# Altium schematic sheet Esquematico.SchDoc
size A4
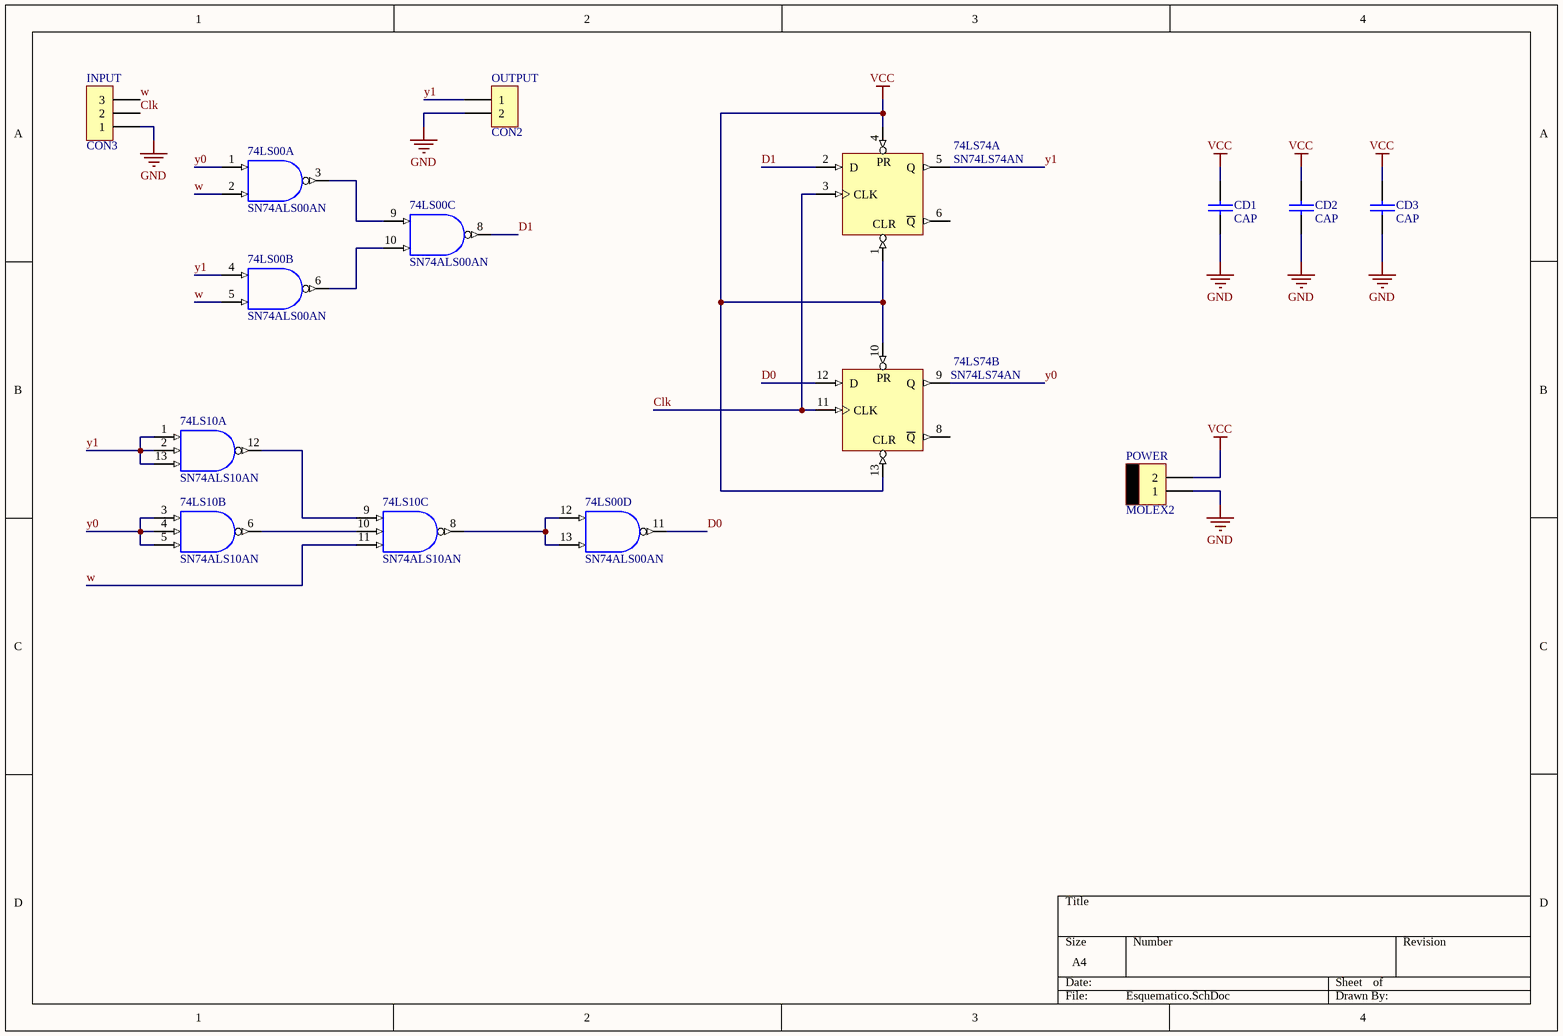
[diagram p0: Esquematico.SchDoc]

## Parts
74LS00  SN74ALS00AN  [N014]  (parts A,B,C,D of 4)
74LS10  SN74ALS10AN  [N014]  (parts A,B,C of 3)
74LS74  SN74LS74AN  [N014D]  (parts A,B of 2)
CD1  CAP  [CAP200]
CD2  CAP  [CAP200]
CD3  CAP  [CAP200]
INPUT  CON3  [SIP3]
OUTPUT  CON2  [SIP2]
POWER  MOLEX2  [MOLEX2]

## Nets
GND: 74LS00.7(GND) 74LS10.7(GND) 74LS74.7(GND) CD1.1 CD2.1 CD3.1 INPUT.1 OUTPUT.2 POWER.1
VCC: 74LS00.14(VCC) 74LS10.14(VCC) 74LS74.1(CLR) 74LS74.4(PR) 74LS74.10(PR) 74LS74.13(CLR) 74LS74.14(VCC) CD1.2 CD2.2 CD3.2 POWER.2
Clk: 74LS74.3(CLK) 74LS74.11(CLK) INPUT.2
D0: 74LS00.11(Y) 74LS74.12(D)
D1: 74LS00.8(Y) 74LS74.2(D)
w: 74LS00.2(B) 74LS00.5(B) 74LS10.11(C) INPUT.3
y0: 74LS00.1(A) 74LS10.3(A) 74LS10.4(B) 74LS10.5(C) 74LS74.9(Q)
y1: 74LS00.4(A) 74LS10.1(A) 74LS10.2(B) 74LS10.13(C) 74LS74.5(Q) OUTPUT.1
Net74LS00_3: 74LS00.3(Y) 74LS00.9(A)
Net74LS00_6: 74LS00.6(Y) 74LS00.10(B)
Net74LS00_12: 74LS00.12(A) 74LS00.13(B) 74LS10.8(Y)
Net74LS10_6: 74LS10.6(Y) 74LS10.10(B)
Net74LS10_9: 74LS10.9(A) 74LS10.12(Y)

Not connected (* = marked no-connect by the designer): 74LS74 6(~{Q}) 8(~{Q})

## Library data of the parts
74LS00 = SN74ALS00AN: Quadruple 2-Input Positive-NAND Gate; Published: 8-Jun-2000; LatestRevisionDate: 04-Mar-2005; LatestRevisionNote: Stylized 3D Model Added.; DatasheetVersion: Dec-1994; PackageVersion: Oct-1995; PackageReference: N014; Publisher: Altium Limited; PackageDescription: DIP; 14 Leads; Row Spacing 7.62 mm; Pitch 2.54 mm; ComponentLink1Description: Manufacturer Link; ComponentLink1URL: http://www.ti.com/; ComponentLink2Description: Datasheet; ComponentLink2URL: http://www-s.ti.com/sc/ds/sn54as00.pdf; ComponentLink3Description: Packaging Specification; ComponentLink3URL: http://focus.ti.com/lit/ml/mpdi002c/mpdi002c.pdf
74LS10 = SN74ALS10AN: Triple 3-Input Positive-NAND Gate; Published: 8-Jun-2000; LatestRevisionDate: 04-Mar-2005; LatestRevisionNote: Stylized 3D Model Added.; DatasheetVersion: Dec-1994; PackageVersion: Oct-1995; PackageReference: N014; Publisher: Altium Limited; PackageDescription: DIP; 14 Leads; Row Spacing 7.62 mm; Pitch 2.54 mm; ComponentLink1Description: Manufacturer Link; ComponentLink1URL: http://www.ti.com/; ComponentLink2Description: Datasheet; ComponentLink2URL: http://www-s.ti.com/sc/ds/sn54as10.pdf; ComponentLink3Description: Packaging Specification; ComponentLink3URL: http://focus.ti.com/lit/ml/mpdi002c/mpdi002c.pdf
74LS74 = SN74LS74AN: Dual D-Type Positive-Edge-Triggered Flip-Flop with Preset and Clear; Published: 8-Jun-2000; LatestRevisionDate: 04-Mar-2005; LatestRevisionNote: Stylized 3D Model Added.; DatasheetVersion: Mar-1988; PackageVersion: Oct-1995; PackageReference: N014D; Publisher: Altium Limited; PackageDescription: DIP; 14 Leads; Row Spacing 7.62 mm; Pitch 2.54 mm; ComponentLink1Description: Manufacturer Link; ComponentLink1URL: http://www.ti.com/; ComponentLink2Description: Datasheet; ComponentLink2URL: http://www-s.ti.com/sc/ds/sn74ls74a.pdf